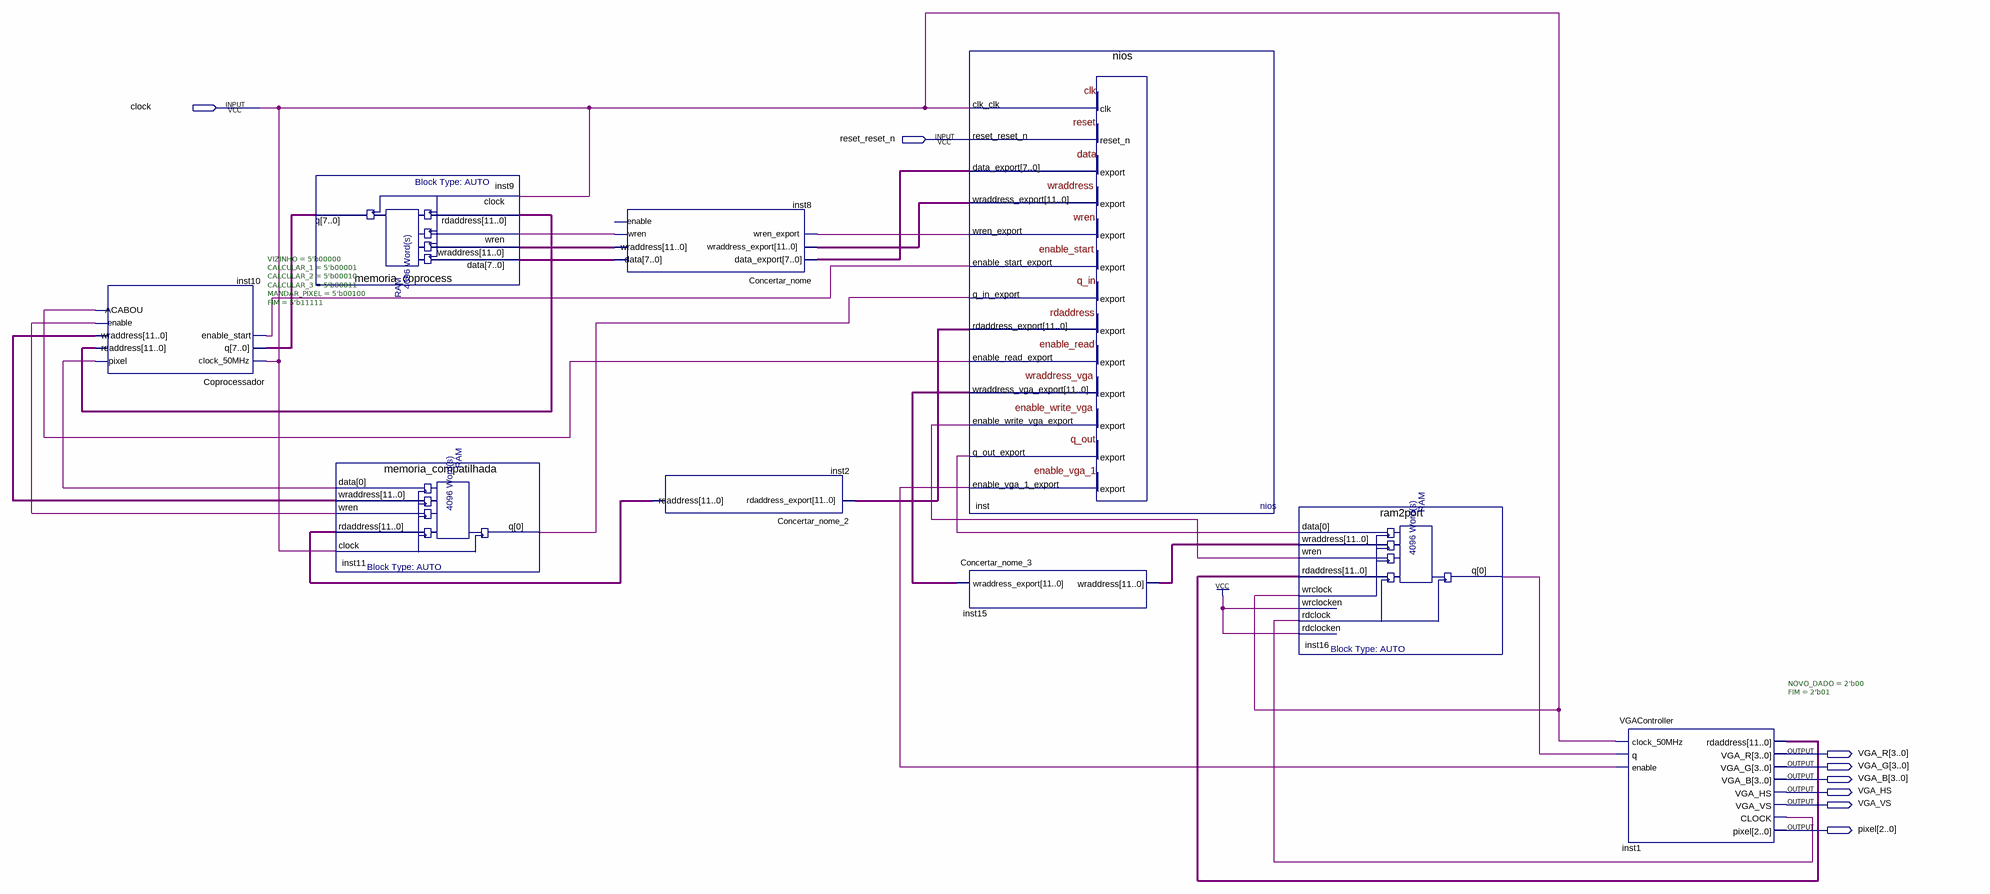
[diagram p0: schematic sheet]
// Quartus schematic PBL3FINAL2.bdf as structural Verilog: 9 symbols, 8 pins
module PBL3FINAL2 (
  input  clock,
  input  reset_reset_n,
  output [3:0] VGA_R,
  output [3:0] VGA_G,
  output [3:0] VGA_B,
  output VGA_HS,
  output VGA_VS,
  output [2:0] pixel
);

  wire inst1_clock, inst8_wren, inst10_acabou, inst10_enable, inst10_pixel, inst11_q, inst16_q,
       inst_enable_start_export, inst_enable_vga_1_export, inst_enable_write_vga_export, inst_q_out_export,
       inst_wren_export;
  wire [7:0] inst8_data, inst9_q, inst_data_export;
  wire [11:0] inst1_rdaddress, inst2_rdaddress, inst8_wraddress, inst10_rdaddress, inst10_wraddress,
       inst15_wraddress, inst_rdaddress_export, inst_wraddress_export, inst_wraddress_vga_export;

  Coprocessador #(.VIZINHO(5'b00000), .CALCULAR_1(5'b00001), .CALCULAR_2(5'b00010), .CALCULAR_3(5'b00011), .MANDAR_PIXEL(5'b00100), .FIM(5'b11111)) inst10 (
    .clock_50MHz(clock), .q(inst9_q), .enable_start(inst_enable_start_export), .pixel(inst10_pixel),
    .rdaddress(inst10_rdaddress), .wraddress(inst10_wraddress), .enable(inst10_enable), .ACABOU(inst10_acabou));
  memoria_coprocess inst9 (
    .data(inst8_data), .wraddress(inst8_wraddress), .wren(inst8_wren), .rdaddress(inst10_rdaddress),
    .clock(clock), .q(inst9_q));
  memoria_compatilhada inst11 (
    .data(inst10_pixel), .wraddress(inst10_wraddress), .wren(inst10_enable), .rdaddress(inst2_rdaddress),
    .clock(clock), .q(inst11_q));
  Concertar_nome inst8 (
    .data_export(inst_data_export), .wraddress_export(inst_wraddress_export), .wren_export(inst_wren_export),
    .data(inst8_data), .wraddress(inst8_wraddress), .wren(inst8_wren));  // open: enable
  Concertar_nome_2 inst2 (.rdaddress_export(inst_rdaddress_export), .rdaddress(inst2_rdaddress));
  Concertar_nome_3 inst15 (.wraddress_export(inst_wraddress_vga_export), .wraddress(inst15_wraddress));
  nios inst (
    .clk_clk(clock), .reset_reset_n(reset_reset_n), .q_in_export(inst11_q),
    .enable_read_export(inst10_acabou), .data_export(inst_data_export),
    .wraddress_export(inst_wraddress_export), .wren_export(inst_wren_export),
    .enable_start_export(inst_enable_start_export), .rdaddress_export(inst_rdaddress_export),
    .wraddress_vga_export(inst_wraddress_vga_export), .enable_write_vga_export(inst_enable_write_vga_export),
    .q_out_export(inst_q_out_export), .enable_vga_1_export(inst_enable_vga_1_export));
  ram2port inst16 (
    .data(inst_q_out_export), .wraddress(inst15_wraddress), .wren(inst_enable_write_vga_export),
    .rdaddress(inst1_rdaddress), .wrclock(clock), .wrclocken(1'b1), .rdclock(inst1_clock), .rdclocken(1'b1),
    .q(inst16_q));
  VGAController #(.NOVO_DADO(2'b00), .FIM(2'b01)) inst1 (
    .clock_50MHz(clock), .q(inst16_q), .enable(inst_enable_vga_1_export), .rdaddress(inst1_rdaddress),
    .VGA_R(VGA_R), .VGA_G(VGA_G), .VGA_B(VGA_B), .VGA_HS(VGA_HS), .VGA_VS(VGA_VS), .CLOCK(inst1_clock),
    .pixel(pixel));
endmodule
